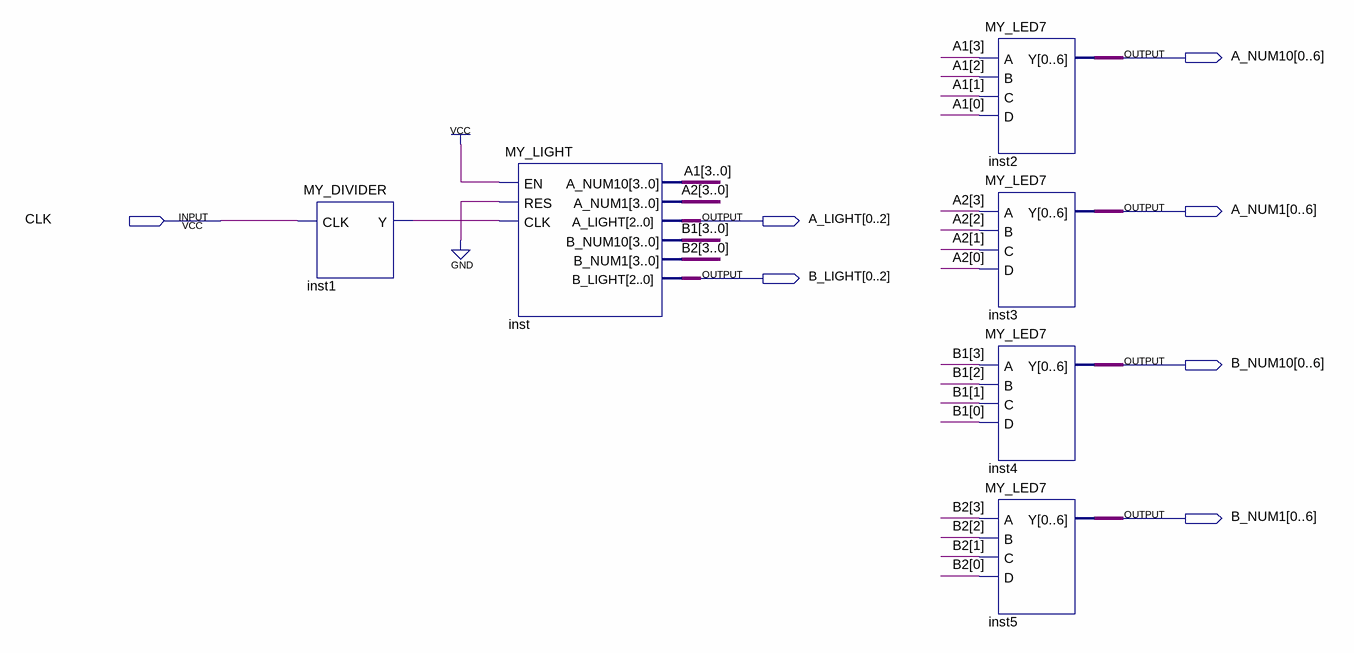
[diagram p0: schematic sheet]
// Quartus schematic TEST_LIGHT.bdf as structural Verilog: 6 symbols, 7 pins
module TEST_LIGHT (
  input  CLK,
  output [0:6] A_NUM10,
  output [0:6] A_NUM1,
  output [0:2] A_LIGHT,
  output [0:2] B_LIGHT,
  output [0:6] B_NUM10,
  output [0:6] B_NUM1
);

  wire inst1_y;
  wire [3:0] A1, A2, B1, B2;

  MY_DIVIDER inst1 (.CLK(CLK), .Y(inst1_y));
  MY_LIGHT inst (
    .EN(1'b1), .RES(1'b0), .CLK(inst1_y), .A_NUM10(A1), .A_NUM1(A2), .A_LIGHT(A_LIGHT), .B_NUM10(B1),
    .B_NUM1(B2), .B_LIGHT(B_LIGHT));
  MY_LED7 inst2 (.A(A1[3]), .B(A1[2]), .C(A1[1]), .D(A1[0]), .Y(A_NUM10));
  MY_LED7 inst3 (.A(A2[3]), .B(A2[2]), .C(A2[1]), .D(A2[0]), .Y(A_NUM1));
  MY_LED7 inst4 (.A(B1[3]), .B(B1[2]), .C(B1[1]), .D(B1[0]), .Y(B_NUM10));
  MY_LED7 inst5 (.A(B2[3]), .B(B2[2]), .C(B2[1]), .D(B2[0]), .Y(B_NUM1));
endmodule
